# Altium schematic sheet PCA_0008_USB_REV_B.SchDoc
size A4
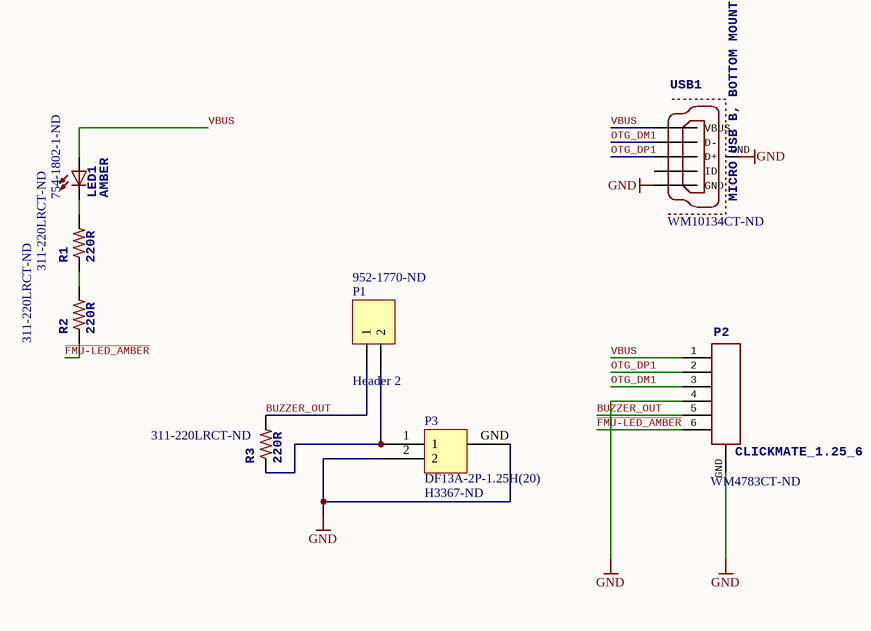
[diagram p0: PCA_0008_USB_REV_B.SchDoc]

## Parts
LED1  AMBER  Supplier Part Number 1: 754-1802-1-ND  [0603-LED]
P1  Header 2  Supplier Part Number 1: 952-1770-ND  [HDR1X2]
P2  CLICKMATE_1.25_6  Supplier Part Number 1: WM4783CT-ND  [CLICKMATE_V6]
P3  DF13A-2P-1.25H(20)  Supplier Part Number 1: H3367-ND  [DF13A-2P-1.25H(20)]
R1  220R  Supplier Part Number 1: 311-220LRCT-ND  [0402-RES]
R2  220R  Supplier Part Number 1: 311-220LRCT-ND  [0402-RES]
R3  220R  Supplier Part Number 1: 311-220LRCT-ND  [0402-RES]
USB1  MICRO USB B, BOTTOM MOUNT  Supplier Part Number 1: WM10134CT-ND  [USB_10513300111051330011_Vert]

## Nets
GND: P2.4 P2.GND P3.2 P3.GND USB1.5(GND) USB1.GND
BUZZER_OUT: P1.1 P2.5 R3.P$2
~{FMU-LED_AMBER}: P2.6 R2.P$1
OTG_DM1: P2.3 USB1.2(D-)
OTG_DP1: P2.2 USB1.3(D+)
VBUS: LED1.A P2.1 USB1.1(VBUS)
NetLED1_C: LED1.C R1.P$2
NetP1_2: P1.2 P3.1 R3.P$1
NetR1_P$1: R1.P$1 R2.P$2

Not connected (* = marked no-connect by the designer): USB1 4(ID)

## Notes on the sheet
- Title:
- Date:
- Time:
- Sheet:
- Approved:
- of:
- Drawn By:
- Checked By:
- 3DRobotics

## Library data of the parts
LED1 = LED0603: PARTNO: APTD1608SECK; 3DR_PARTNO: ECM0515; Supplier 1: Digi-Key
P1 = Header 2: Header, 2-Pin; LatestRevisionDate: 17-Jul-2002; LatestRevisionNote: Re-released for DXP Platform.; Publisher: Altium Limited; Supplier 1: Digi-Key
P2 = CLICKMATE_1.25_6: 3DR_PARTNO: ECM0520; Supplier 1: Digi-Key
R1-R3 = RESISTOR0402-RES: PARTNO: RC0402FR-07220RL; 3DR_PARTNO: ECM0821; Supplier 1: Digi-Key
USB1 = MOLEX-1051330011-VERT: Supplier 1: Digi-Key
P3 = DF13A-2P-1.25H(20): Supplier 1: Digi-Key